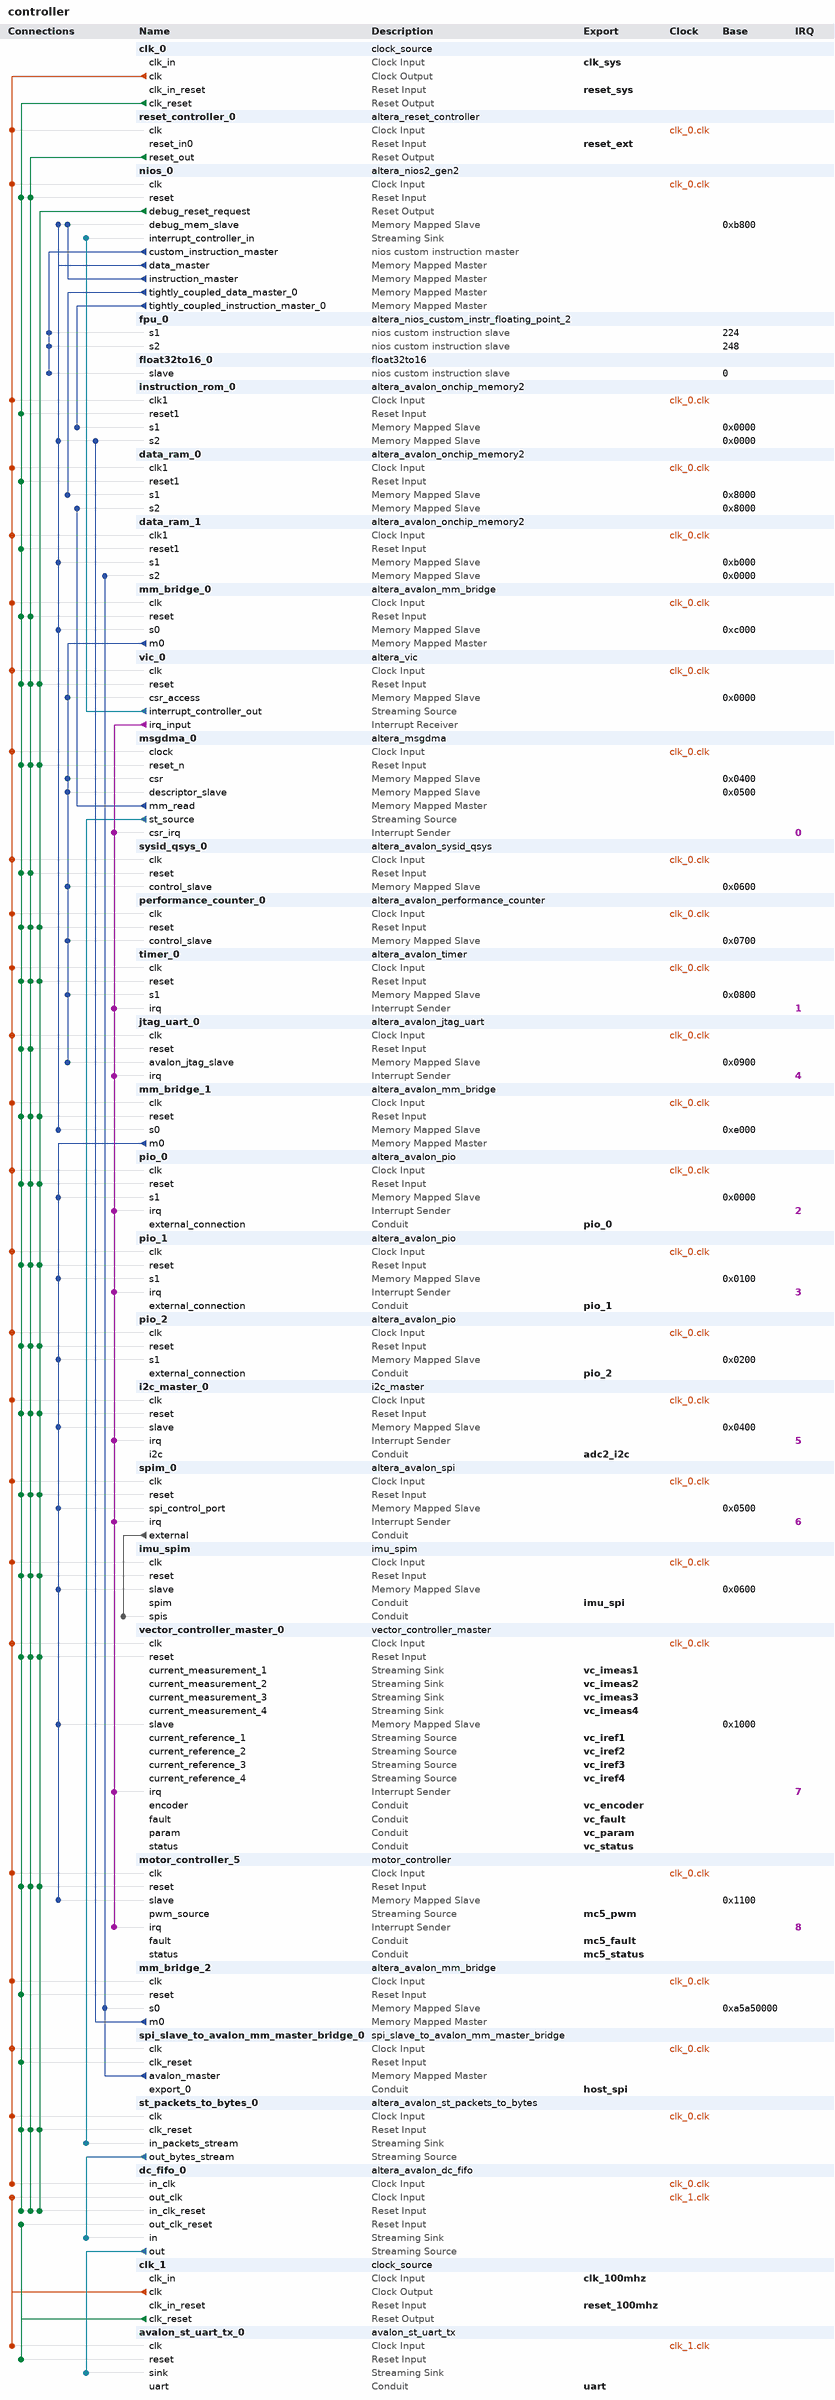
[diagram p0: system contents]
# Platform Designer (Qsys) system controller, Cyclone 10 LP 10CL025YU256C8G
# Parameters at their usual value, and those the tool derives, are not listed.
package require -exact qsys 23.1
create_system controller
set_project_property DEVICE_FAMILY {Cyclone 10 LP}
set_project_property DEVICE 10CL025YU256C8G

add_instance clk_0 clock_source 23.1
set_instance_parameter_value clk_0 clockFrequency 75000000
set_instance_parameter_value clk_0 resetSynchronousEdges DEASSERT

add_instance reset_controller_0 altera_reset_controller 23.1
set_instance_parameter_value reset_controller_0 NUM_RESET_INPUTS 1
set_instance_parameter_value reset_controller_0 SYNC_DEPTH 2

add_instance nios_0 altera_nios2_gen2 23.1
set_instance_parameter_value nios_0 dcache_numTCDM 1
set_instance_parameter_value nios_0 dcache_size 0
set_instance_parameter_value nios_0 dividerType srt2
set_instance_parameter_value nios_0 exceptionSlave instruction_rom_0.s1
set_instance_parameter_value nios_0 icache_numTCIM 1
set_instance_parameter_value nios_0 icache_size 0
set_instance_parameter_value nios_0 impl Fast
set_instance_parameter_value nios_0 resetSlave instruction_rom_0.s1
set_instance_parameter_value nios_0 setting_branchpredictiontype Static
set_instance_parameter_value nios_0 setting_interruptControllerType External
set_instance_parameter_value nios_0 setting_shadowRegisterSets 3

add_instance fpu_0 altera_nios_custom_instr_floating_point_2 23.1
set_instance_parameter_value fpu_0 arithmetic_present true
set_instance_parameter_value fpu_0 comparison_present true
set_instance_parameter_value fpu_0 conversion_present true
set_instance_parameter_value fpu_0 root_present true

add_instance float32to16_0 float32to16 1.0

add_instance instruction_rom_0 altera_avalon_onchip_memory2 23.1
set_instance_parameter_value instruction_rom_0 dataWidth 32
set_instance_parameter_value instruction_rom_0 dualPort true
set_instance_parameter_value instruction_rom_0 initMemContent true
set_instance_parameter_value instruction_rom_0 initializationFileName onchip_mem.hex
set_instance_parameter_value instruction_rom_0 memorySize 32768
set_instance_parameter_value instruction_rom_0 readDuringWriteMode OLD_DATA
set_instance_parameter_value instruction_rom_0 singleClockOperation true

add_instance data_ram_0 altera_avalon_onchip_memory2 23.1
set_instance_parameter_value data_ram_0 dataWidth 32
set_instance_parameter_value data_ram_0 dualPort true
set_instance_parameter_value data_ram_0 initMemContent true
set_instance_parameter_value data_ram_0 initializationFileName onchip_mem.hex
set_instance_parameter_value data_ram_0 memorySize 8192
set_instance_parameter_value data_ram_0 readDuringWriteMode OLD_DATA
set_instance_parameter_value data_ram_0 singleClockOperation true

add_instance data_ram_1 altera_avalon_onchip_memory2 23.1
set_instance_parameter_value data_ram_1 dataWidth 32
set_instance_parameter_value data_ram_1 dualPort true
set_instance_parameter_value data_ram_1 initMemContent true
set_instance_parameter_value data_ram_1 initializationFileName onchip_mem.hex
set_instance_parameter_value data_ram_1 memorySize 1024
set_instance_parameter_value data_ram_1 readDuringWriteMode OLD_DATA
set_instance_parameter_value data_ram_1 singleClockOperation true

add_instance mm_bridge_0 altera_avalon_mm_bridge 23.1
set_instance_parameter_value mm_bridge_0 ADDRESS_UNITS SYMBOLS
set_instance_parameter_value mm_bridge_0 ADDRESS_WIDTH 13
set_instance_parameter_value mm_bridge_0 DATA_WIDTH 32
set_instance_parameter_value mm_bridge_0 MAX_PENDING_RESPONSES 4
set_instance_parameter_value mm_bridge_0 USE_AUTO_ADDRESS_WIDTH 0

add_instance vic_0 altera_vic 23.1
set_instance_parameter_value vic_0 DAISY_CHAIN_ENABLE 0
set_instance_parameter_value vic_0 INTERRUPT_LATENCY_CYCLES 2
set_instance_parameter_value vic_0 NUMBER_OF_INT_PORTS 9
set_instance_parameter_value vic_0 OVERRIDE_INTERRUPT_LATENCY false
set_instance_parameter_value vic_0 RIL_WIDTH 2

add_instance msgdma_0 altera_msgdma 23.1
set_instance_parameter_value msgdma_0 BURST_ENABLE 0
set_instance_parameter_value msgdma_0 CHANNEL_ENABLE 1
set_instance_parameter_value msgdma_0 DATA_FIFO_DEPTH 128
set_instance_parameter_value msgdma_0 DATA_WIDTH 8
set_instance_parameter_value msgdma_0 DESCRIPTOR_FIFO_DEPTH 128
set_instance_parameter_value msgdma_0 ENHANCED_FEATURES 0
set_instance_parameter_value msgdma_0 ERROR_ENABLE 0
set_instance_parameter_value msgdma_0 MAX_BURST_COUNT 2
set_instance_parameter_value msgdma_0 MAX_BYTE 1024
set_instance_parameter_value msgdma_0 MODE 1
set_instance_parameter_value msgdma_0 PACKET_ENABLE 1
set_instance_parameter_value msgdma_0 TRANSFER_TYPE {Aligned Accesses}

add_instance sysid_qsys_0 altera_avalon_sysid_qsys 23.1
set_instance_parameter_value sysid_qsys_0 id -889275714

add_instance performance_counter_0 altera_avalon_performance_counter 23.1
set_instance_parameter_value performance_counter_0 numberOfSections 1

add_instance timer_0 altera_avalon_timer 23.1
set_instance_parameter_value timer_0 fixedPeriod true
set_instance_parameter_value timer_0 period 2
set_instance_parameter_value timer_0 periodUnits MSEC
set_instance_parameter_value timer_0 snapshot false

add_instance jtag_uart_0 altera_avalon_jtag_uart 23.1
set_instance_parameter_value jtag_uart_0 readBufferDepth 512
set_instance_parameter_value jtag_uart_0 simInteractiveOptions NO_INTERACTIVE_WINDOWS
set_instance_parameter_value jtag_uart_0 writeBufferDepth 512

add_instance mm_bridge_1 altera_avalon_mm_bridge 23.1
set_instance_parameter_value mm_bridge_1 ADDRESS_UNITS SYMBOLS
set_instance_parameter_value mm_bridge_1 ADDRESS_WIDTH 13
set_instance_parameter_value mm_bridge_1 DATA_WIDTH 32
set_instance_parameter_value mm_bridge_1 MAX_PENDING_RESPONSES 4
set_instance_parameter_value mm_bridge_1 USE_AUTO_ADDRESS_WIDTH 0

add_instance pio_0 altera_avalon_pio 23.1
set_instance_parameter_value pio_0 captureEdge true
set_instance_parameter_value pio_0 direction Input
set_instance_parameter_value pio_0 generateIRQ true
set_instance_parameter_value pio_0 irqType EDGE
set_instance_parameter_value pio_0 simDoTestBenchWiring true
set_instance_parameter_value pio_0 width 1

add_instance pio_1 altera_avalon_pio 23.1
set_instance_parameter_value pio_1 direction Input
set_instance_parameter_value pio_1 edgeType FALLING
set_instance_parameter_value pio_1 generateIRQ true
set_instance_parameter_value pio_1 simDoTestBenchWiring true
set_instance_parameter_value pio_1 simDrivenValue 4294967295
set_instance_parameter_value pio_1 width 32

add_instance pio_2 altera_avalon_pio 23.1
set_instance_parameter_value pio_2 bitModifyingOutReg true
set_instance_parameter_value pio_2 direction Output
set_instance_parameter_value pio_2 width 10

add_instance i2c_master_0 i2c_master 1.0
set_instance_parameter_value i2c_master_0 PRESCALER 188

add_instance spim_0 altera_avalon_spi 23.1
set_instance_parameter_value spim_0 clockPolarity 0
set_instance_parameter_value spim_0 dataWidth 8
set_instance_parameter_value spim_0 masterSPI true
set_instance_parameter_value spim_0 numberOfSlaves 1
set_instance_parameter_value spim_0 targetClockRate 20000000

add_instance imu_spim imu_spim 1.0
set_instance_parameter_value imu_spim PRESCALER 2

add_instance vector_controller_master_0 vector_controller_master 1.0

add_instance motor_controller_5 motor_controller 1.0

add_instance mm_bridge_2 altera_avalon_mm_bridge 23.1
set_instance_parameter_value mm_bridge_2 ADDRESS_UNITS SYMBOLS
set_instance_parameter_value mm_bridge_2 ADDRESS_WIDTH 10
set_instance_parameter_value mm_bridge_2 DATA_WIDTH 32
set_instance_parameter_value mm_bridge_2 MAX_PENDING_RESPONSES 4
set_instance_parameter_value mm_bridge_2 USE_AUTO_ADDRESS_WIDTH 1

add_instance spi_slave_to_avalon_mm_master_bridge_0 spi_slave_to_avalon_mm_master_bridge 23.1
set_instance_parameter_value spi_slave_to_avalon_mm_master_bridge_0 SYNC_DEPTH 2

add_instance st_packets_to_bytes_0 altera_avalon_st_packets_to_bytes 23.1
set_instance_parameter_value st_packets_to_bytes_0 CHANNEL_WIDTH 8
set_instance_parameter_value st_packets_to_bytes_0 ENCODING 0

add_instance dc_fifo_0 altera_avalon_dc_fifo 23.1
set_instance_parameter_value dc_fifo_0 BITS_PER_SYMBOL 8
set_instance_parameter_value dc_fifo_0 FIFO_DEPTH 128
set_instance_parameter_value dc_fifo_0 USE_PACKETS 0

add_instance clk_1 clock_source 23.1
set_instance_parameter_value clk_1 clockFrequency 100000000

add_instance avalon_st_uart_tx_0 avalon_st_uart_tx 1.0
set_instance_parameter_value avalon_st_uart_tx_0 BAUD_RATE 4000000
set_instance_parameter_value avalon_st_uart_tx_0 CLOCK_RATE 100000000

# connections
add_connection clk_0.clk data_ram_0.clk1 clock
add_connection clk_0.clk data_ram_1.clk1 clock
add_connection clk_0.clk dc_fifo_0.in_clk clock
add_connection clk_0.clk i2c_master_0.clk clock
add_connection clk_0.clk imu_spim.clk clock
add_connection clk_0.clk instruction_rom_0.clk1 clock
add_connection clk_0.clk jtag_uart_0.clk clock
add_connection clk_0.clk mm_bridge_0.clk clock
add_connection clk_0.clk mm_bridge_1.clk clock
add_connection clk_0.clk mm_bridge_2.clk clock
add_connection clk_0.clk motor_controller_5.clk clock
add_connection clk_0.clk msgdma_0.clock clock
add_connection clk_0.clk nios_0.clk clock
add_connection clk_0.clk performance_counter_0.clk clock
add_connection clk_0.clk pio_0.clk clock
add_connection clk_0.clk pio_1.clk clock
add_connection clk_0.clk pio_2.clk clock
add_connection clk_0.clk reset_controller_0.clk clock
add_connection clk_0.clk spi_slave_to_avalon_mm_master_bridge_0.clk clock
add_connection clk_0.clk spim_0.clk clock
add_connection clk_0.clk st_packets_to_bytes_0.clk clock
add_connection clk_0.clk sysid_qsys_0.clk clock
add_connection clk_0.clk timer_0.clk clock
add_connection clk_0.clk vector_controller_master_0.clk clock
add_connection clk_0.clk vic_0.clk clock
add_connection clk_1.clk avalon_st_uart_tx_0.clk clock
add_connection clk_1.clk dc_fifo_0.out_clk clock
add_connection clk_0.clk_reset data_ram_0.reset1 reset
add_connection clk_0.clk_reset data_ram_1.reset1 reset
add_connection clk_0.clk_reset dc_fifo_0.in_clk_reset reset
add_connection clk_0.clk_reset i2c_master_0.reset reset
add_connection clk_0.clk_reset imu_spim.reset reset
add_connection clk_0.clk_reset instruction_rom_0.reset1 reset
add_connection clk_0.clk_reset jtag_uart_0.reset reset
add_connection clk_0.clk_reset mm_bridge_0.reset reset
add_connection clk_0.clk_reset mm_bridge_1.reset reset
add_connection clk_0.clk_reset mm_bridge_2.reset reset
add_connection clk_0.clk_reset motor_controller_5.reset reset
add_connection clk_0.clk_reset msgdma_0.reset_n reset
add_connection clk_0.clk_reset nios_0.reset reset
add_connection clk_0.clk_reset performance_counter_0.reset reset
add_connection clk_0.clk_reset pio_0.reset reset
add_connection clk_0.clk_reset pio_1.reset reset
add_connection clk_0.clk_reset pio_2.reset reset
add_connection clk_0.clk_reset spi_slave_to_avalon_mm_master_bridge_0.clk_reset reset
add_connection clk_0.clk_reset spim_0.reset reset
add_connection clk_0.clk_reset st_packets_to_bytes_0.clk_reset reset
add_connection clk_0.clk_reset sysid_qsys_0.reset reset
add_connection clk_0.clk_reset timer_0.reset reset
add_connection clk_0.clk_reset vector_controller_master_0.reset reset
add_connection clk_0.clk_reset vic_0.reset reset
add_connection clk_1.clk_reset avalon_st_uart_tx_0.reset reset
add_connection clk_1.clk_reset dc_fifo_0.out_clk_reset reset
add_connection nios_0.debug_reset_request dc_fifo_0.in_clk_reset reset
add_connection nios_0.debug_reset_request i2c_master_0.reset reset
add_connection nios_0.debug_reset_request imu_spim.reset reset
add_connection nios_0.debug_reset_request mm_bridge_1.reset reset
add_connection nios_0.debug_reset_request motor_controller_5.reset reset
add_connection nios_0.debug_reset_request msgdma_0.reset_n reset
add_connection nios_0.debug_reset_request performance_counter_0.reset reset
add_connection nios_0.debug_reset_request pio_0.reset reset
add_connection nios_0.debug_reset_request pio_1.reset reset
add_connection nios_0.debug_reset_request pio_2.reset reset
add_connection nios_0.debug_reset_request spim_0.reset reset
add_connection nios_0.debug_reset_request st_packets_to_bytes_0.clk_reset reset
add_connection nios_0.debug_reset_request timer_0.reset reset
add_connection nios_0.debug_reset_request vector_controller_master_0.reset reset
add_connection nios_0.debug_reset_request vic_0.reset reset
add_connection reset_controller_0.reset_out dc_fifo_0.in_clk_reset reset
add_connection reset_controller_0.reset_out i2c_master_0.reset reset
add_connection reset_controller_0.reset_out imu_spim.reset reset
add_connection reset_controller_0.reset_out jtag_uart_0.reset reset
add_connection reset_controller_0.reset_out mm_bridge_0.reset reset
add_connection reset_controller_0.reset_out mm_bridge_1.reset reset
add_connection reset_controller_0.reset_out motor_controller_5.reset reset
add_connection reset_controller_0.reset_out msgdma_0.reset_n reset
add_connection reset_controller_0.reset_out nios_0.reset reset
add_connection reset_controller_0.reset_out performance_counter_0.reset reset
add_connection reset_controller_0.reset_out pio_0.reset reset
add_connection reset_controller_0.reset_out pio_1.reset reset
add_connection reset_controller_0.reset_out pio_2.reset reset
add_connection reset_controller_0.reset_out spim_0.reset reset
add_connection reset_controller_0.reset_out st_packets_to_bytes_0.clk_reset reset
add_connection reset_controller_0.reset_out sysid_qsys_0.reset reset
add_connection reset_controller_0.reset_out timer_0.reset reset
add_connection reset_controller_0.reset_out vector_controller_master_0.reset reset
add_connection reset_controller_0.reset_out vic_0.reset reset
add_connection mm_bridge_0.m0 jtag_uart_0.avalon_jtag_slave avalon
set_connection_parameter_value mm_bridge_0.m0/jtag_uart_0.avalon_jtag_slave baseAddress 0x0900
add_connection mm_bridge_0.m0 msgdma_0.csr avalon
set_connection_parameter_value mm_bridge_0.m0/msgdma_0.csr baseAddress 0x0400
add_connection mm_bridge_0.m0 msgdma_0.descriptor_slave avalon
set_connection_parameter_value mm_bridge_0.m0/msgdma_0.descriptor_slave baseAddress 0x0500
add_connection mm_bridge_0.m0 performance_counter_0.control_slave avalon
set_connection_parameter_value mm_bridge_0.m0/performance_counter_0.control_slave baseAddress 0x0700
add_connection mm_bridge_0.m0 sysid_qsys_0.control_slave avalon
set_connection_parameter_value mm_bridge_0.m0/sysid_qsys_0.control_slave baseAddress 0x0600
add_connection mm_bridge_0.m0 timer_0.s1 avalon
set_connection_parameter_value mm_bridge_0.m0/timer_0.s1 baseAddress 0x0800
add_connection mm_bridge_0.m0 vic_0.csr_access avalon
set_connection_parameter_value mm_bridge_0.m0/vic_0.csr_access baseAddress 0x0000
add_connection mm_bridge_1.m0 i2c_master_0.slave avalon
set_connection_parameter_value mm_bridge_1.m0/i2c_master_0.slave baseAddress 0x0400
add_connection mm_bridge_1.m0 imu_spim.slave avalon
set_connection_parameter_value mm_bridge_1.m0/imu_spim.slave baseAddress 0x0600
add_connection mm_bridge_1.m0 motor_controller_5.slave avalon
set_connection_parameter_value mm_bridge_1.m0/motor_controller_5.slave baseAddress 0x1100
add_connection mm_bridge_1.m0 pio_0.s1 avalon
set_connection_parameter_value mm_bridge_1.m0/pio_0.s1 baseAddress 0x0000
add_connection mm_bridge_1.m0 pio_1.s1 avalon
set_connection_parameter_value mm_bridge_1.m0/pio_1.s1 baseAddress 0x0100
add_connection mm_bridge_1.m0 pio_2.s1 avalon
set_connection_parameter_value mm_bridge_1.m0/pio_2.s1 baseAddress 0x0200
add_connection mm_bridge_1.m0 spim_0.spi_control_port avalon
set_connection_parameter_value mm_bridge_1.m0/spim_0.spi_control_port baseAddress 0x0500
add_connection mm_bridge_1.m0 vector_controller_master_0.slave avalon
set_connection_parameter_value mm_bridge_1.m0/vector_controller_master_0.slave baseAddress 0x1000
add_connection mm_bridge_2.m0 instruction_rom_0.s2 avalon
set_connection_parameter_value mm_bridge_2.m0/instruction_rom_0.s2 baseAddress 0x0000
add_connection msgdma_0.mm_read data_ram_0.s2 avalon
set_connection_parameter_value msgdma_0.mm_read/data_ram_0.s2 baseAddress 0x8000
add_connection nios_0.data_master data_ram_1.s1 avalon
set_connection_parameter_value nios_0.data_master/data_ram_1.s1 baseAddress 0xb000
add_connection nios_0.data_master instruction_rom_0.s2 avalon
set_connection_parameter_value nios_0.data_master/instruction_rom_0.s2 baseAddress 0x0000
add_connection nios_0.data_master mm_bridge_0.s0 avalon
set_connection_parameter_value nios_0.data_master/mm_bridge_0.s0 baseAddress 0xc000
add_connection nios_0.data_master mm_bridge_1.s0 avalon
set_connection_parameter_value nios_0.data_master/mm_bridge_1.s0 baseAddress 0xe000
add_connection nios_0.data_master nios_0.debug_mem_slave avalon
set_connection_parameter_value nios_0.data_master/nios_0.debug_mem_slave baseAddress 0xb800
add_connection nios_0.instruction_master nios_0.debug_mem_slave avalon
set_connection_parameter_value nios_0.instruction_master/nios_0.debug_mem_slave baseAddress 0xb800
add_connection nios_0.tightly_coupled_data_master_0 data_ram_0.s1 avalon
set_connection_parameter_value nios_0.tightly_coupled_data_master_0/data_ram_0.s1 baseAddress 0x8000
add_connection nios_0.tightly_coupled_instruction_master_0 instruction_rom_0.s1 avalon
set_connection_parameter_value nios_0.tightly_coupled_instruction_master_0/instruction_rom_0.s1 baseAddress 0x0000
add_connection spi_slave_to_avalon_mm_master_bridge_0.avalon_master data_ram_1.s2 avalon
set_connection_parameter_value spi_slave_to_avalon_mm_master_bridge_0.avalon_master/data_ram_1.s2 baseAddress 0x0000
add_connection spi_slave_to_avalon_mm_master_bridge_0.avalon_master mm_bridge_2.s0 avalon
set_connection_parameter_value spi_slave_to_avalon_mm_master_bridge_0.avalon_master/mm_bridge_2.s0 baseAddress 0xa5a50000
add_connection dc_fifo_0.out avalon_st_uart_tx_0.sink avalon_streaming
add_connection msgdma_0.st_source st_packets_to_bytes_0.in_packets_stream avalon_streaming
add_connection st_packets_to_bytes_0.out_bytes_stream dc_fifo_0.in avalon_streaming
add_connection vic_0.interrupt_controller_out nios_0.interrupt_controller_in avalon_streaming
add_connection spim_0.external imu_spim.spis conduit
add_connection vic_0.irq_input i2c_master_0.irq interrupt
set_connection_parameter_value vic_0.irq_input/i2c_master_0.irq irqNumber 5
add_connection vic_0.irq_input jtag_uart_0.irq interrupt
set_connection_parameter_value vic_0.irq_input/jtag_uart_0.irq irqNumber 4
add_connection vic_0.irq_input motor_controller_5.irq interrupt
set_connection_parameter_value vic_0.irq_input/motor_controller_5.irq irqNumber 8
add_connection vic_0.irq_input msgdma_0.csr_irq interrupt
set_connection_parameter_value vic_0.irq_input/msgdma_0.csr_irq irqNumber 0
add_connection vic_0.irq_input pio_0.irq interrupt
set_connection_parameter_value vic_0.irq_input/pio_0.irq irqNumber 2
add_connection vic_0.irq_input pio_1.irq interrupt
set_connection_parameter_value vic_0.irq_input/pio_1.irq irqNumber 3
add_connection vic_0.irq_input spim_0.irq interrupt
set_connection_parameter_value vic_0.irq_input/spim_0.irq irqNumber 6
add_connection vic_0.irq_input timer_0.irq interrupt
set_connection_parameter_value vic_0.irq_input/timer_0.irq irqNumber 1
add_connection vic_0.irq_input vector_controller_master_0.irq interrupt
set_connection_parameter_value vic_0.irq_input/vector_controller_master_0.irq irqNumber 7
add_connection nios_0.custom_instruction_master float32to16_0.slave nios_custom_instruction
set_connection_parameter_value nios_0.custom_instruction_master/float32to16_0.slave CIName float32to16_0
set_connection_parameter_value nios_0.custom_instruction_master/float32to16_0.slave baseAddress 0
add_connection nios_0.custom_instruction_master fpu_0.s1 nios_custom_instruction
set_connection_parameter_value nios_0.custom_instruction_master/fpu_0.s1 CIName nios_custom_instr_floating_point_2_0
set_connection_parameter_value nios_0.custom_instruction_master/fpu_0.s1 baseAddress 224
add_connection nios_0.custom_instruction_master fpu_0.s2 nios_custom_instruction
set_connection_parameter_value nios_0.custom_instruction_master/fpu_0.s2 CIName nios_custom_instr_floating_point_2_0_1
set_connection_parameter_value nios_0.custom_instruction_master/fpu_0.s2 baseAddress 248

# exported interfaces
add_interface adc2_i2c conduit end
set_interface_property adc2_i2c EXPORT_OF i2c_master_0.i2c
add_interface clk_100mhz clock sink
set_interface_property clk_100mhz EXPORT_OF clk_1.clk_in
add_interface clk_sys clock sink
set_interface_property clk_sys EXPORT_OF clk_0.clk_in
add_interface host_spi conduit end
set_interface_property host_spi EXPORT_OF spi_slave_to_avalon_mm_master_bridge_0.export_0
add_interface imu_spi conduit end
set_interface_property imu_spi EXPORT_OF imu_spim.spim
add_interface mc5_fault conduit end
set_interface_property mc5_fault EXPORT_OF motor_controller_5.fault
add_interface mc5_pwm avalon_streaming source
set_interface_property mc5_pwm EXPORT_OF motor_controller_5.pwm_source
add_interface mc5_status conduit end
set_interface_property mc5_status EXPORT_OF motor_controller_5.status
add_interface pio_0 conduit end
set_interface_property pio_0 EXPORT_OF pio_0.external_connection
add_interface pio_1 conduit end
set_interface_property pio_1 EXPORT_OF pio_1.external_connection
add_interface pio_2 conduit end
set_interface_property pio_2 EXPORT_OF pio_2.external_connection
add_interface reset_100mhz reset sink
set_interface_property reset_100mhz EXPORT_OF clk_1.clk_in_reset
add_interface reset_ext reset sink
set_interface_property reset_ext EXPORT_OF reset_controller_0.reset_in0
add_interface reset_sys reset sink
set_interface_property reset_sys EXPORT_OF clk_0.clk_in_reset
add_interface uart conduit end
set_interface_property uart EXPORT_OF avalon_st_uart_tx_0.uart
add_interface vc_encoder conduit end
set_interface_property vc_encoder EXPORT_OF vector_controller_master_0.encoder
add_interface vc_fault conduit end
set_interface_property vc_fault EXPORT_OF vector_controller_master_0.fault
add_interface vc_imeas1 avalon_streaming sink
set_interface_property vc_imeas1 EXPORT_OF vector_controller_master_0.current_measurement_1
add_interface vc_imeas2 avalon_streaming sink
set_interface_property vc_imeas2 EXPORT_OF vector_controller_master_0.current_measurement_2
add_interface vc_imeas3 avalon_streaming sink
set_interface_property vc_imeas3 EXPORT_OF vector_controller_master_0.current_measurement_3
add_interface vc_imeas4 avalon_streaming sink
set_interface_property vc_imeas4 EXPORT_OF vector_controller_master_0.current_measurement_4
add_interface vc_iref1 avalon_streaming source
set_interface_property vc_iref1 EXPORT_OF vector_controller_master_0.current_reference_1
add_interface vc_iref2 avalon_streaming source
set_interface_property vc_iref2 EXPORT_OF vector_controller_master_0.current_reference_2
add_interface vc_iref3 avalon_streaming source
set_interface_property vc_iref3 EXPORT_OF vector_controller_master_0.current_reference_3
add_interface vc_iref4 avalon_streaming source
set_interface_property vc_iref4 EXPORT_OF vector_controller_master_0.current_reference_4
add_interface vc_param conduit end
set_interface_property vc_param EXPORT_OF vector_controller_master_0.param
add_interface vc_status conduit end
set_interface_property vc_status EXPORT_OF vector_controller_master_0.status

set_interconnect_requirement {$system} qsys_mm.clockCrossingAdapter HANDSHAKE
set_interconnect_requirement {$system} qsys_mm.enableEccProtection FALSE
set_interconnect_requirement {$system} qsys_mm.insertDefaultSlave FALSE
set_interconnect_requirement {$system} qsys_mm.maxAdditionalLatency 1

save_system controller.qsys
